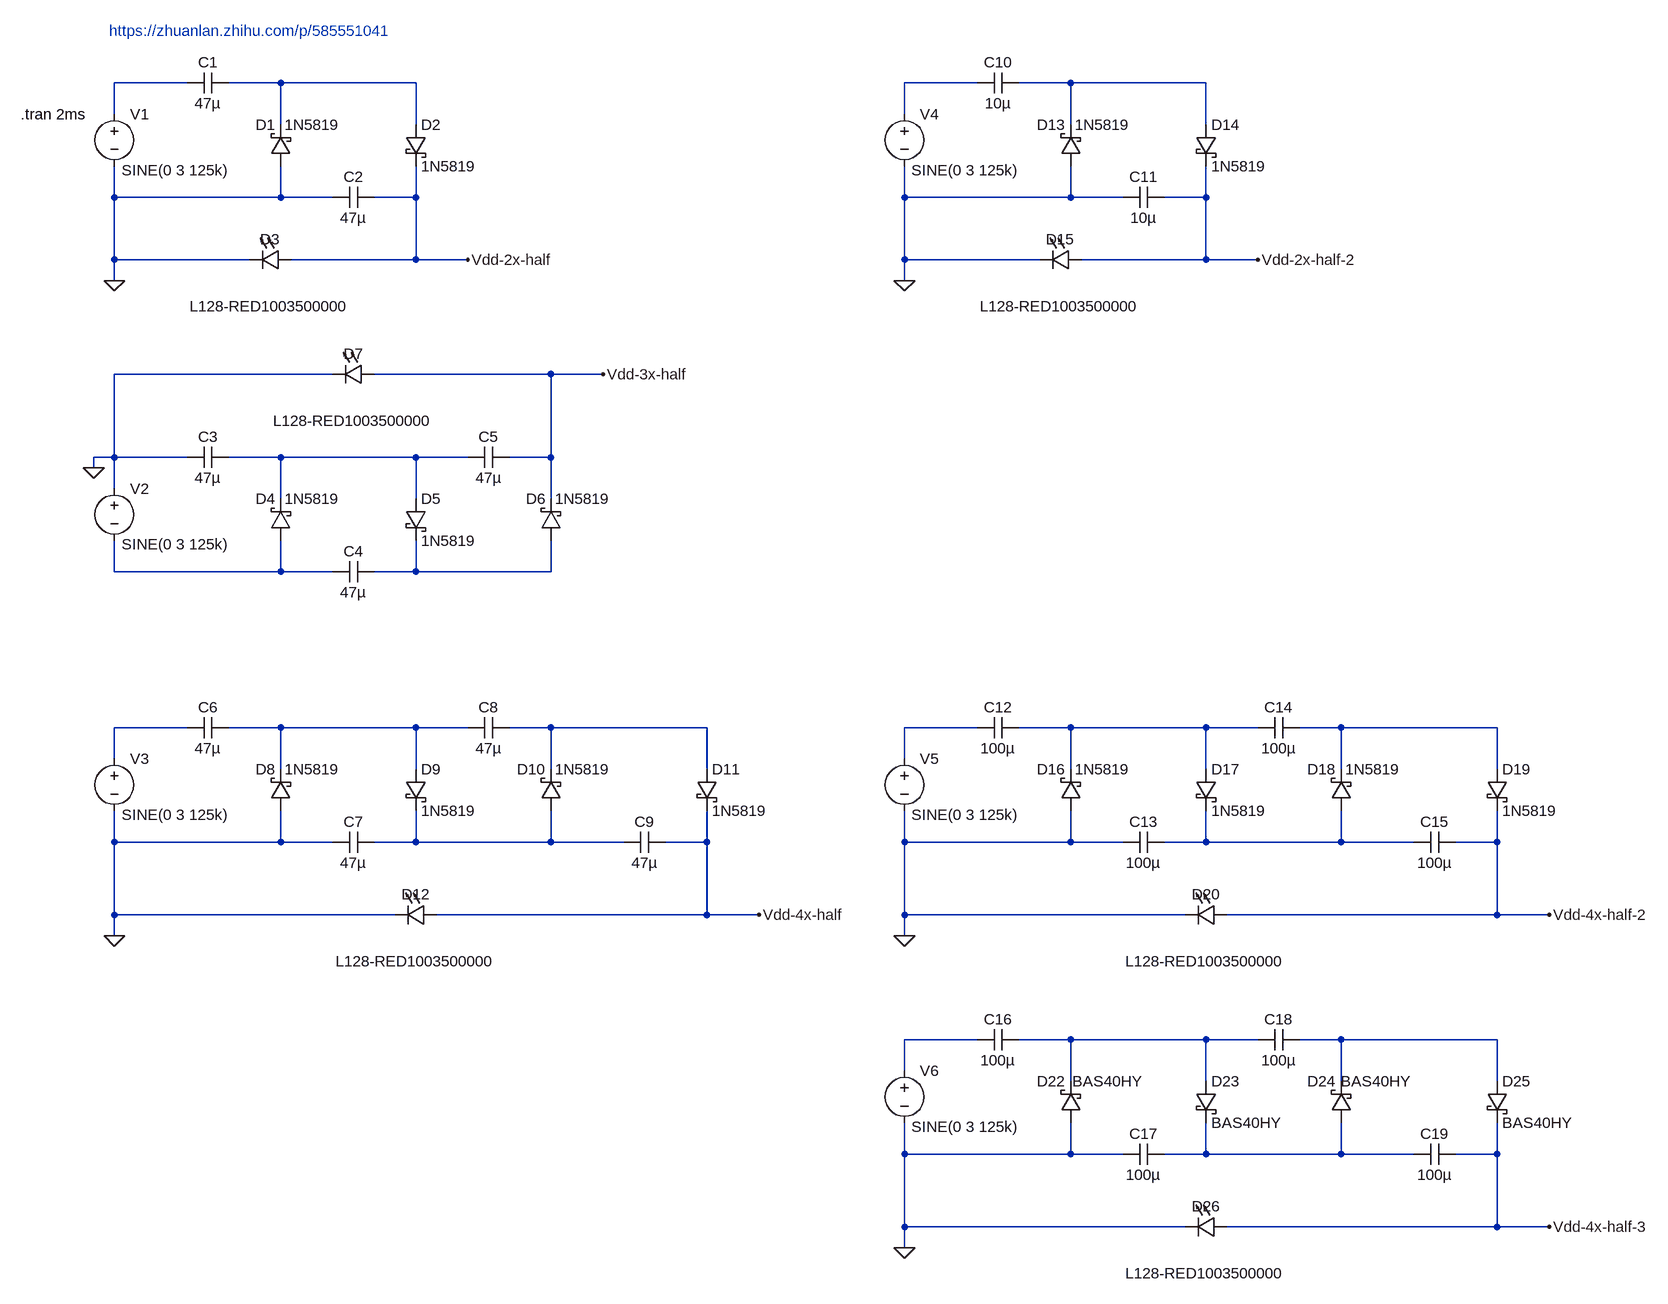
[diagram p0: schematic 125k.asc]
125k.asc, the LTspice schematic file:
Version 4
SHEET 1 2228 2472
WIRE -48 16 -160 16
WIRE 96 16 16 16
WIRE 304 16 96 16
WIRE 1168 16 1056 16
WIRE 1312 16 1232 16
WIRE 1520 16 1312 16
WIRE -160 64 -160 16
WIRE 1056 64 1056 16
WIRE 96 80 96 16
WIRE 304 80 304 16
WIRE 1312 80 1312 16
WIRE 1520 80 1520 16
WIRE -160 192 -160 144
WIRE 96 192 96 144
WIRE 96 192 -160 192
WIRE 176 192 96 192
WIRE 304 192 304 144
WIRE 304 192 240 192
WIRE 1056 192 1056 144
WIRE 1312 192 1312 144
WIRE 1312 192 1056 192
WIRE 1392 192 1312 192
WIRE 1520 192 1520 144
WIRE 1520 192 1456 192
WIRE -160 288 -160 192
WIRE 48 288 -160 288
WIRE 304 288 304 192
WIRE 304 288 112 288
WIRE 384 288 304 288
WIRE 1056 288 1056 192
WIRE 1264 288 1056 288
WIRE 1520 288 1520 192
WIRE 1520 288 1328 288
WIRE 1600 288 1520 288
WIRE -160 320 -160 288
WIRE 1056 320 1056 288
WIRE 176 464 -160 464
WIRE 512 464 240 464
WIRE 592 464 512 464
WIRE -160 592 -160 464
WIRE -160 592 -192 592
WIRE -48 592 -160 592
WIRE 96 592 16 592
WIRE 304 592 96 592
WIRE 384 592 304 592
WIRE 512 592 512 464
WIRE 512 592 448 592
WIRE -192 608 -192 592
WIRE -160 640 -160 592
WIRE 96 656 96 592
WIRE 304 656 304 592
WIRE 512 656 512 592
WIRE -160 768 -160 720
WIRE 96 768 96 720
WIRE 96 768 -160 768
WIRE 176 768 96 768
WIRE 304 768 304 720
WIRE 304 768 240 768
WIRE 512 768 512 720
WIRE 512 768 304 768
WIRE -48 1008 -160 1008
WIRE 96 1008 16 1008
WIRE 304 1008 96 1008
WIRE 384 1008 304 1008
WIRE 512 1008 448 1008
WIRE 752 1008 512 1008
WIRE 1168 1008 1056 1008
WIRE 1312 1008 1232 1008
WIRE 1520 1008 1312 1008
WIRE 1600 1008 1520 1008
WIRE 1728 1008 1664 1008
WIRE 1968 1008 1728 1008
WIRE -160 1056 -160 1008
WIRE 1056 1056 1056 1008
WIRE 96 1072 96 1008
WIRE 304 1072 304 1008
WIRE 512 1072 512 1008
WIRE 752 1072 752 1008
WIRE 1312 1072 1312 1008
WIRE 1520 1072 1520 1008
WIRE 1728 1072 1728 1008
WIRE 1968 1072 1968 1008
WIRE -160 1184 -160 1136
WIRE 96 1184 96 1136
WIRE 96 1184 -160 1184
WIRE 176 1184 96 1184
WIRE 304 1184 304 1136
WIRE 304 1184 240 1184
WIRE 512 1184 512 1136
WIRE 512 1184 304 1184
WIRE 624 1184 512 1184
WIRE 752 1184 752 1136
WIRE 752 1184 688 1184
WIRE 1056 1184 1056 1136
WIRE 1312 1184 1312 1136
WIRE 1312 1184 1056 1184
WIRE 1392 1184 1312 1184
WIRE 1520 1184 1520 1136
WIRE 1520 1184 1456 1184
WIRE 1728 1184 1728 1136
WIRE 1728 1184 1520 1184
WIRE 1840 1184 1728 1184
WIRE 1968 1184 1968 1136
WIRE 1968 1184 1904 1184
WIRE -160 1296 -160 1184
WIRE 272 1296 -160 1296
WIRE 752 1296 752 1184
WIRE 752 1296 336 1296
WIRE 832 1296 752 1296
WIRE 1056 1296 1056 1184
WIRE 1488 1296 1056 1296
WIRE 1968 1296 1968 1184
WIRE 1968 1296 1552 1296
WIRE 2048 1296 1968 1296
WIRE -160 1328 -160 1296
WIRE 1056 1328 1056 1296
WIRE 1168 1488 1056 1488
WIRE 1312 1488 1232 1488
WIRE 1520 1488 1312 1488
WIRE 1600 1488 1520 1488
WIRE 1728 1488 1664 1488
WIRE 1968 1488 1728 1488
WIRE 1056 1536 1056 1488
WIRE 1312 1552 1312 1488
WIRE 1520 1552 1520 1488
WIRE 1728 1552 1728 1488
WIRE 1968 1552 1968 1488
WIRE 1056 1664 1056 1616
WIRE 1312 1664 1312 1616
WIRE 1312 1664 1056 1664
WIRE 1392 1664 1312 1664
WIRE 1520 1664 1520 1616
WIRE 1520 1664 1456 1664
WIRE 1728 1664 1728 1616
WIRE 1728 1664 1520 1664
WIRE 1840 1664 1728 1664
WIRE 1968 1664 1968 1616
WIRE 1968 1664 1904 1664
WIRE 1056 1776 1056 1664
WIRE 1488 1776 1056 1776
WIRE 1968 1776 1968 1664
WIRE 1968 1776 1552 1776
WIRE 2048 1776 1968 1776
WIRE 1056 1808 1056 1776
FLAG -160 320 0
FLAG -192 608 0
FLAG -160 1328 0
FLAG 592 464 Vdd-3x-half
FLAG 384 288 Vdd-2x-half
FLAG 832 1296 Vdd-4x-half
FLAG 1056 320 0
FLAG 1600 288 Vdd-2x-half-2
FLAG 1056 1328 0
FLAG 2048 1296 Vdd-4x-half-2
FLAG 1056 1808 0
FLAG 2048 1776 Vdd-4x-half-3
SYMBOL cap 16 0 R90
WINDOW 0 0 32 VBottom 2
WINDOW 3 32 32 VTop 2
SYMATTR InstName C1
SYMATTR Value 47µ
SYMATTR SpiceLine V=6.3 Irms=10.8 Rser=0.00432531 Lser=0 mfg="KEMET" pn="C0603C106K9PAC" type="X5R"
SYMBOL schottky 112 144 R180
WINDOW 0 24 64 Left 2
WINDOW 3 -75 64 Left 2
SYMATTR InstName D1
SYMATTR Value 1N5819
SYMATTR Description Diode
SYMATTR Type diode
SYMBOL schottky 288 80 R0
SYMATTR InstName D2
SYMATTR Value 1N5819
SYMATTR Description Diode
SYMATTR Type diode
SYMBOL cap 176 208 R270
WINDOW 0 32 32 VTop 2
WINDOW 3 0 32 VBottom 2
SYMATTR InstName C2
SYMATTR Value 47µ
SYMATTR SpiceLine V=6.3 Irms=10.8 Rser=0.00432531 Lser=0 mfg="KEMET" pn="C0603C106K9PAC" type="X5R"
SYMBOL voltage -160 48 R0
WINDOW 3 11 102 Left 2
WINDOW 123 0 0 Left 0
WINDOW 39 0 0 Left 0
SYMATTR Value SINE(0 3 125k)
SYMATTR InstName V1
SYMBOL LED 112 272 R90
WINDOW 0 0 32 VBottom 2
WINDOW 3 72 32 VTop 2
SYMATTR InstName D3
SYMATTR Value L128-RED1003500000
SYMATTR Description Diode
SYMATTR Type diode
SYMBOL cap 16 576 R90
WINDOW 0 0 32 VBottom 2
WINDOW 3 32 32 VTop 2
SYMATTR InstName C3
SYMATTR Value 47µ
SYMATTR SpiceLine V=6.3 Irms=10.8 Rser=0.00432531 Lser=0 mfg="KEMET" pn="C0603C106K9PAC" type="X5R"
SYMBOL schottky 112 720 R180
WINDOW 0 24 64 Left 2
WINDOW 3 -75 64 Left 2
SYMATTR InstName D4
SYMATTR Value 1N5819
SYMATTR Description Diode
SYMATTR Type diode
SYMBOL schottky 288 656 R0
SYMATTR InstName D5
SYMATTR Value 1N5819
SYMATTR Description Diode
SYMATTR Type diode
SYMBOL cap 176 784 R270
WINDOW 0 32 32 VTop 2
WINDOW 3 0 32 VBottom 2
SYMATTR InstName C4
SYMATTR Value 47µ
SYMATTR SpiceLine V=6.3 Irms=10.8 Rser=0.00432531 Lser=0 mfg="KEMET" pn="C0603C106K9PAC" type="X5R"
SYMBOL voltage -160 624 R0
WINDOW 3 11 102 Left 2
WINDOW 123 0 0 Left 0
WINDOW 39 0 0 Left 0
SYMATTR Value SINE(0 3 125k)
SYMATTR InstName V2
SYMBOL cap 448 576 R90
WINDOW 0 0 32 VBottom 2
WINDOW 3 32 32 VTop 2
SYMATTR InstName C5
SYMATTR Value 47µ
SYMATTR SpiceLine V=6.3 Irms=10.8 Rser=0.00432531 Lser=0 mfg="KEMET" pn="C0603C106K9PAC" type="X5R"
SYMBOL schottky 528 720 R180
WINDOW 0 24 64 Left 2
WINDOW 3 -75 64 Left 2
SYMATTR InstName D6
SYMATTR Value 1N5819
SYMATTR Description Diode
SYMATTR Type diode
SYMBOL LED 240 448 R90
WINDOW 0 0 32 VBottom 2
WINDOW 3 72 32 VTop 2
SYMATTR InstName D7
SYMATTR Value L128-RED1003500000
SYMATTR Description Diode
SYMATTR Type diode
SYMBOL cap 16 992 R90
WINDOW 0 0 32 VBottom 2
WINDOW 3 32 32 VTop 2
SYMATTR InstName C6
SYMATTR Value 47µ
SYMATTR SpiceLine V=6.3 Irms=10.8 Rser=0.00432531 Lser=0
SYMBOL schottky 112 1136 R180
WINDOW 0 24 64 Left 2
WINDOW 3 -75 64 Left 2
SYMATTR InstName D8
SYMATTR Value 1N5819
SYMATTR Description Diode
SYMATTR Type diode
SYMBOL schottky 288 1072 R0
SYMATTR InstName D9
SYMATTR Value 1N5819
SYMATTR Description Diode
SYMATTR Type diode
SYMBOL cap 176 1200 R270
WINDOW 0 32 32 VTop 2
WINDOW 3 0 32 VBottom 2
SYMATTR InstName C7
SYMATTR Value 47µ
SYMATTR SpiceLine V=6.3 Irms=10.8 Rser=0.00432531 Lser=0 mfg="KEMET" pn="C0603C106K9PAC" type="X5R"
SYMBOL voltage -160 1040 R0
WINDOW 3 11 102 Left 2
WINDOW 123 0 0 Left 0
WINDOW 39 0 0 Left 0
SYMATTR Value SINE(0 3 125k)
SYMATTR InstName V3
SYMBOL cap 448 992 R90
WINDOW 0 0 32 VBottom 2
WINDOW 3 32 32 VTop 2
SYMATTR InstName C8
SYMATTR Value 47µ
SYMATTR SpiceLine V=6.3 Irms=10.8 Rser=0.00432531 Lser=0 mfg="KEMET" pn="C0603C106K9PAC" type="X5R"
SYMBOL schottky 528 1136 R180
WINDOW 0 24 64 Left 2
WINDOW 3 -75 64 Left 2
SYMATTR InstName D10
SYMATTR Value 1N5819
SYMATTR Description Diode
SYMATTR Type diode
SYMBOL schottky 736 1072 R0
SYMATTR InstName D11
SYMATTR Value 1N5819
SYMATTR Description Diode
SYMATTR Type diode
SYMBOL cap 624 1200 R270
WINDOW 0 32 32 VTop 2
WINDOW 3 0 32 VBottom 2
SYMATTR InstName C9
SYMATTR Value 47µ
SYMATTR SpiceLine V=6.3 Irms=10.8 Rser=0.00432531 Lser=0 mfg="KEMET" pn="C0603C106K9PAC" type="X5R"
SYMBOL LED 336 1280 R90
WINDOW 0 0 32 VBottom 2
WINDOW 3 72 32 VTop 2
SYMATTR InstName D12
SYMATTR Value L128-RED1003500000
SYMATTR Description Diode
SYMATTR Type diode
SYMBOL cap 1232 0 R90
WINDOW 0 0 32 VBottom 2
WINDOW 3 32 32 VTop 2
SYMATTR InstName C10
SYMATTR Value 10µ
SYMATTR SpiceLine V=6.3 Irms=10.8 Rser=0.00432531 Lser=0 mfg="KEMET" pn="C0603C106K9PAC" type="X5R"
SYMBOL schottky 1328 144 R180
WINDOW 0 24 64 Left 2
WINDOW 3 -75 64 Left 2
SYMATTR InstName D13
SYMATTR Value 1N5819
SYMATTR Description Diode
SYMATTR Type diode
SYMBOL schottky 1504 80 R0
SYMATTR InstName D14
SYMATTR Value 1N5819
SYMATTR Description Diode
SYMATTR Type diode
SYMBOL cap 1392 208 R270
WINDOW 0 32 32 VTop 2
WINDOW 3 0 32 VBottom 2
SYMATTR InstName C11
SYMATTR Value 10µ
SYMATTR SpiceLine V=6.3 Irms=10.8 Rser=0.00432531 Lser=0 mfg="KEMET" pn="C0603C106K9PAC" type="X5R"
SYMBOL voltage 1056 48 R0
WINDOW 3 11 102 Left 2
WINDOW 123 0 0 Left 0
WINDOW 39 0 0 Left 0
SYMATTR Value SINE(0 3 125k)
SYMATTR InstName V4
SYMBOL LED 1328 272 R90
WINDOW 0 0 32 VBottom 2
WINDOW 3 72 32 VTop 2
SYMATTR InstName D15
SYMATTR Value L128-RED1003500000
SYMATTR Description Diode
SYMATTR Type diode
SYMBOL cap 1232 992 R90
WINDOW 0 0 32 VBottom 2
WINDOW 3 32 32 VTop 2
SYMATTR InstName C12
SYMATTR Value 100µ
SYMATTR SpiceLine V=6.3 Irms=10.8 Rser=0.00432531 Lser=0
SYMBOL schottky 1328 1136 R180
WINDOW 0 24 64 Left 2
WINDOW 3 -75 64 Left 2
SYMATTR InstName D16
SYMATTR Value 1N5819
SYMATTR Description Diode
SYMATTR Type diode
SYMBOL schottky 1504 1072 R0
SYMATTR InstName D17
SYMATTR Value 1N5819
SYMATTR Description Diode
SYMATTR Type diode
SYMBOL cap 1392 1200 R270
WINDOW 0 32 32 VTop 2
WINDOW 3 0 32 VBottom 2
SYMATTR InstName C13
SYMATTR Value 100µ
SYMATTR SpiceLine V=6.3 Irms=10.8 Rser=0.00432531 Lser=0 mfg="KEMET" pn="C0603C106K9PAC" type="X5R"
SYMBOL voltage 1056 1040 R0
WINDOW 3 11 102 Left 2
WINDOW 123 0 0 Left 0
WINDOW 39 0 0 Left 0
SYMATTR Value SINE(0 3 125k)
SYMATTR InstName V5
SYMBOL cap 1664 992 R90
WINDOW 0 0 32 VBottom 2
WINDOW 3 32 32 VTop 2
SYMATTR InstName C14
SYMATTR Value 100µ
SYMATTR SpiceLine V=6.3 Irms=10.8 Rser=0.00432531 Lser=0 mfg="KEMET" pn="C0603C106K9PAC" type="X5R"
SYMBOL schottky 1744 1136 R180
WINDOW 0 24 64 Left 2
WINDOW 3 -75 64 Left 2
SYMATTR InstName D18
SYMATTR Value 1N5819
SYMATTR Description Diode
SYMATTR Type diode
SYMBOL schottky 1952 1072 R0
SYMATTR InstName D19
SYMATTR Value 1N5819
SYMATTR Description Diode
SYMATTR Type diode
SYMBOL cap 1840 1200 R270
WINDOW 0 32 32 VTop 2
WINDOW 3 0 32 VBottom 2
SYMATTR InstName C15
SYMATTR Value 100µ
SYMATTR SpiceLine V=6.3 Irms=10.8 Rser=0.00432531 Lser=0 mfg="KEMET" pn="C0603C106K9PAC" type="X5R"
SYMBOL LED 1552 1280 R90
WINDOW 0 0 32 VBottom 2
WINDOW 3 72 32 VTop 2
SYMATTR InstName D20
SYMATTR Value L128-RED1003500000
SYMATTR Description Diode
SYMATTR Type diode
SYMBOL cap 1232 1472 R90
WINDOW 0 0 32 VBottom 2
WINDOW 3 32 32 VTop 2
SYMATTR InstName C16
SYMATTR Value 100µ
SYMATTR SpiceLine V=6.3 Irms=10.8 Rser=0.00432531 Lser=0
SYMBOL schottky 1328 1616 R180
WINDOW 0 24 64 Left 2
WINDOW 3 -94 64 Left 2
SYMATTR InstName D22
SYMATTR Value BAS40HY
SYMATTR Description Diode
SYMATTR Type diode
SYMBOL schottky 1504 1552 R0
SYMATTR InstName D23
SYMATTR Value BAS40HY
SYMATTR Description Diode
SYMATTR Type diode
SYMBOL cap 1392 1680 R270
WINDOW 0 32 32 VTop 2
WINDOW 3 0 32 VBottom 2
SYMATTR InstName C17
SYMATTR Value 100µ
SYMATTR SpiceLine V=6.3 Irms=10.8 Rser=0.00432531 Lser=0 mfg="KEMET" pn="C0603C106K9PAC" type="X5R"
SYMBOL voltage 1056 1520 R0
WINDOW 3 11 102 Left 2
WINDOW 123 0 0 Left 0
WINDOW 39 0 0 Left 0
SYMATTR Value SINE(0 3 125k)
SYMATTR InstName V6
SYMBOL cap 1664 1472 R90
WINDOW 0 0 32 VBottom 2
WINDOW 3 32 32 VTop 2
SYMATTR InstName C18
SYMATTR Value 100µ
SYMATTR SpiceLine V=6.3 Irms=10.8 Rser=0.00432531 Lser=0 mfg="KEMET" pn="C0603C106K9PAC" type="X5R"
SYMBOL schottky 1744 1616 R180
WINDOW 0 24 64 Left 2
WINDOW 3 -91 64 Left 2
SYMATTR InstName D24
SYMATTR Value BAS40HY
SYMATTR Description Diode
SYMATTR Type diode
SYMBOL schottky 1952 1552 R0
SYMATTR InstName D25
SYMATTR Value BAS40HY
SYMATTR Description Diode
SYMATTR Type diode
SYMBOL cap 1840 1680 R270
WINDOW 0 32 32 VTop 2
WINDOW 3 0 32 VBottom 2
SYMATTR InstName C19
SYMATTR Value 100µ
SYMATTR SpiceLine V=6.3 Irms=10.8 Rser=0.00432531 Lser=0 mfg="KEMET" pn="C0603C106K9PAC" type="X5R"
SYMBOL LED 1552 1760 R90
WINDOW 0 0 32 VBottom 2
WINDOW 3 72 32 VTop 2
SYMATTR InstName D26
SYMATTR Value L128-RED1003500000
SYMATTR Description Diode
SYMATTR Type diode
TEXT -304 64 Left 2 !.tran 2ms
TEXT -168 -64 Left 2 ;https://zhuanlan.zhihu.com/p/585551041

The netlist it stands for:
* 125k.asc
C1 N002 N001 47µ V=6.3 Irms=10.8 Rser=0.00432531 Lser=0 mfg="KEMET" pn="C0603C106K9PAC" type="X5R"
D1 0 N002 1N5819
D2 N002 Vdd-2x-half 1N5819
C2 0 Vdd-2x-half 47µ V=6.3 Irms=10.8 Rser=0.00432531 Lser=0 mfg="KEMET" pn="C0603C106K9PAC" type="X5R"
V1 N001 0 SINE(0 3 125k)
D3 Vdd-2x-half 0 L128-RED1003500000
C3 N005 0 47µ V=6.3 Irms=10.8 Rser=0.00432531 Lser=0 mfg="KEMET" pn="C0603C106K9PAC" type="X5R"
D4 N006 N005 1N5819
D5 N005 N007 1N5819
C4 N006 N007 47µ V=6.3 Irms=10.8 Rser=0.00432531 Lser=0 mfg="KEMET" pn="C0603C106K9PAC" type="X5R"
V2 0 N006 SINE(0 3 125k)
C5 Vdd-3x-half N005 47µ V=6.3 Irms=10.8 Rser=0.00432531 Lser=0 mfg="KEMET" pn="C0603C106K9PAC" type="X5R"
D6 N007 Vdd-3x-half 1N5819
D7 Vdd-3x-half 0 L128-RED1003500000
C6 N009 N008 47µ V=6.3 Irms=10.8 Rser=0.00432531 Lser=0
D8 0 N009 1N5819
D9 N009 N014 1N5819
C7 0 N014 47µ V=6.3 Irms=10.8 Rser=0.00432531 Lser=0 mfg="KEMET" pn="C0603C106K9PAC" type="X5R"
V3 N008 0 SINE(0 3 125k)
C8 N010 N009 47µ V=6.3 Irms=10.8 Rser=0.00432531 Lser=0 mfg="KEMET" pn="C0603C106K9PAC" type="X5R"
D10 N014 N010 1N5819
D11 N010 Vdd-4x-half 1N5819
C9 N014 Vdd-4x-half 47µ V=6.3 Irms=10.8 Rser=0.00432531 Lser=0 mfg="KEMET" pn="C0603C106K9PAC" type="X5R"
D12 Vdd-4x-half 0 L128-RED1003500000
C10 N004 N003 10µ V=6.3 Irms=10.8 Rser=0.00432531 Lser=0 mfg="KEMET" pn="C0603C106K9PAC" type="X5R"
D13 0 N004 1N5819
D14 N004 Vdd-2x-half-2 1N5819
C11 0 Vdd-2x-half-2 10µ V=6.3 Irms=10.8 Rser=0.00432531 Lser=0 mfg="KEMET" pn="C0603C106K9PAC" type="X5R"
V4 N003 0 SINE(0 3 125k)
D15 Vdd-2x-half-2 0 L128-RED1003500000
C12 N012 N011 100µ V=6.3 Irms=10.8 Rser=0.00432531 Lser=0
D16 0 N012 1N5819
D17 N012 N015 1N5819
C13 0 N015 100µ V=6.3 Irms=10.8 Rser=0.00432531 Lser=0 mfg="KEMET" pn="C0603C106K9PAC" type="X5R"
V5 N011 0 SINE(0 3 125k)
C14 N013 N012 100µ V=6.3 Irms=10.8 Rser=0.00432531 Lser=0 mfg="KEMET" pn="C0603C106K9PAC" type="X5R"
D18 N015 N013 1N5819
D19 N013 Vdd-4x-half-2 1N5819
C15 N015 Vdd-4x-half-2 100µ V=6.3 Irms=10.8 Rser=0.00432531 Lser=0 mfg="KEMET" pn="C0603C106K9PAC" type="X5R"
D20 Vdd-4x-half-2 0 L128-RED1003500000
C16 N017 N016 100µ V=6.3 Irms=10.8 Rser=0.00432531 Lser=0
D22 0 N017 BAS40HY
D23 N017 N019 BAS40HY
C17 0 N019 100µ V=6.3 Irms=10.8 Rser=0.00432531 Lser=0 mfg="KEMET" pn="C0603C106K9PAC" type="X5R"
V6 N016 0 SINE(0 3 125k)
C18 N018 N017 100µ V=6.3 Irms=10.8 Rser=0.00432531 Lser=0 mfg="KEMET" pn="C0603C106K9PAC" type="X5R"
D24 N019 N018 BAS40HY
D25 N018 Vdd-4x-half-3 BAS40HY
C19 N019 Vdd-4x-half-3 100µ V=6.3 Irms=10.8 Rser=0.00432531 Lser=0 mfg="KEMET" pn="C0603C106K9PAC" type="X5R"
D26 Vdd-4x-half-3 0 L128-RED1003500000
.model D D
.lib standard.dio
.tran 2ms
* https://zhuanlan.zhihu.com/p/585551041
.backanno
.end